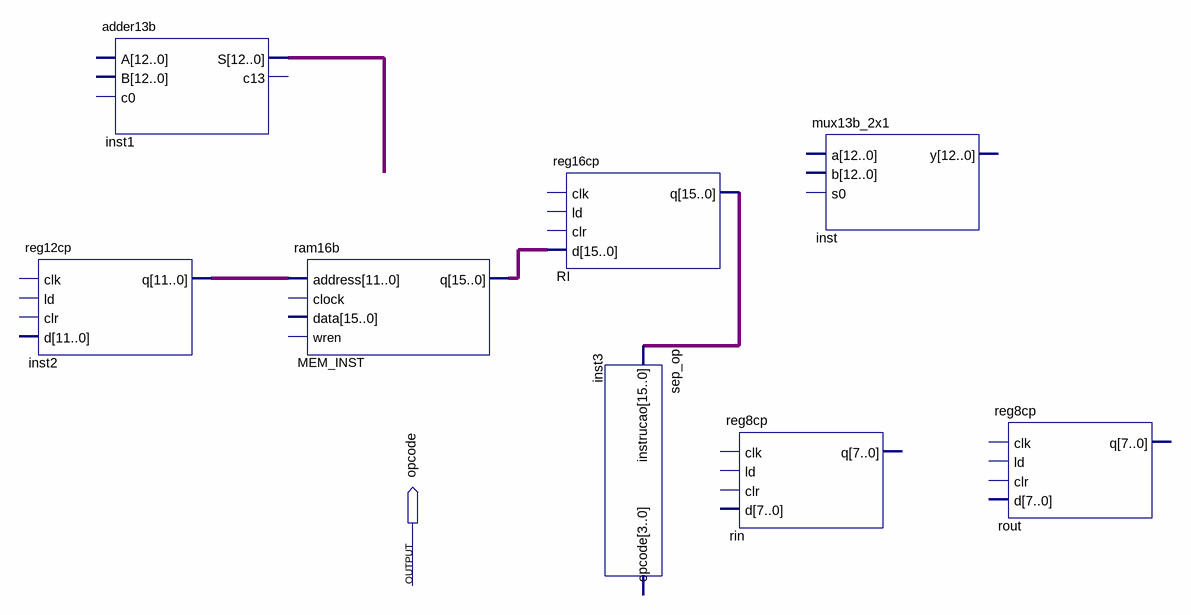
[diagram p0: schematic sheet]
// Quartus schematic processador.bdf as structural Verilog: 8 symbols, 1 pins
module processador (
  output opcode
);

  wire [11:0] inst2_q;
  wire [12:0] inst1_s;
  wire [15:0] MEM_INST_q, RI_q;

  reg12cp inst2 (.q(inst2_q));  // open: clk, ld, clr, d
  adder13b inst1 (.S(inst1_s));  // open: A, B, c0, c13
  ram16b MEM_INST (.address(inst2_q), .q(MEM_INST_q));  // open: clock, data, wren
  reg16cp RI (.d(MEM_INST_q), .q(RI_q));  // open: clk, ld, clr
  sep_op inst3 (.instrucao(RI_q));  // open: opcode
  reg8cp rin ();  // open: clk, ld, clr, d, q
  mux13b_2x1 inst ();  // open: a, b, s0, y
  reg8cp rout ();  // open: clk, ld, clr, d, q
endmodule
